# Altium schematic sheet mainsheet.SchDoc
size A4
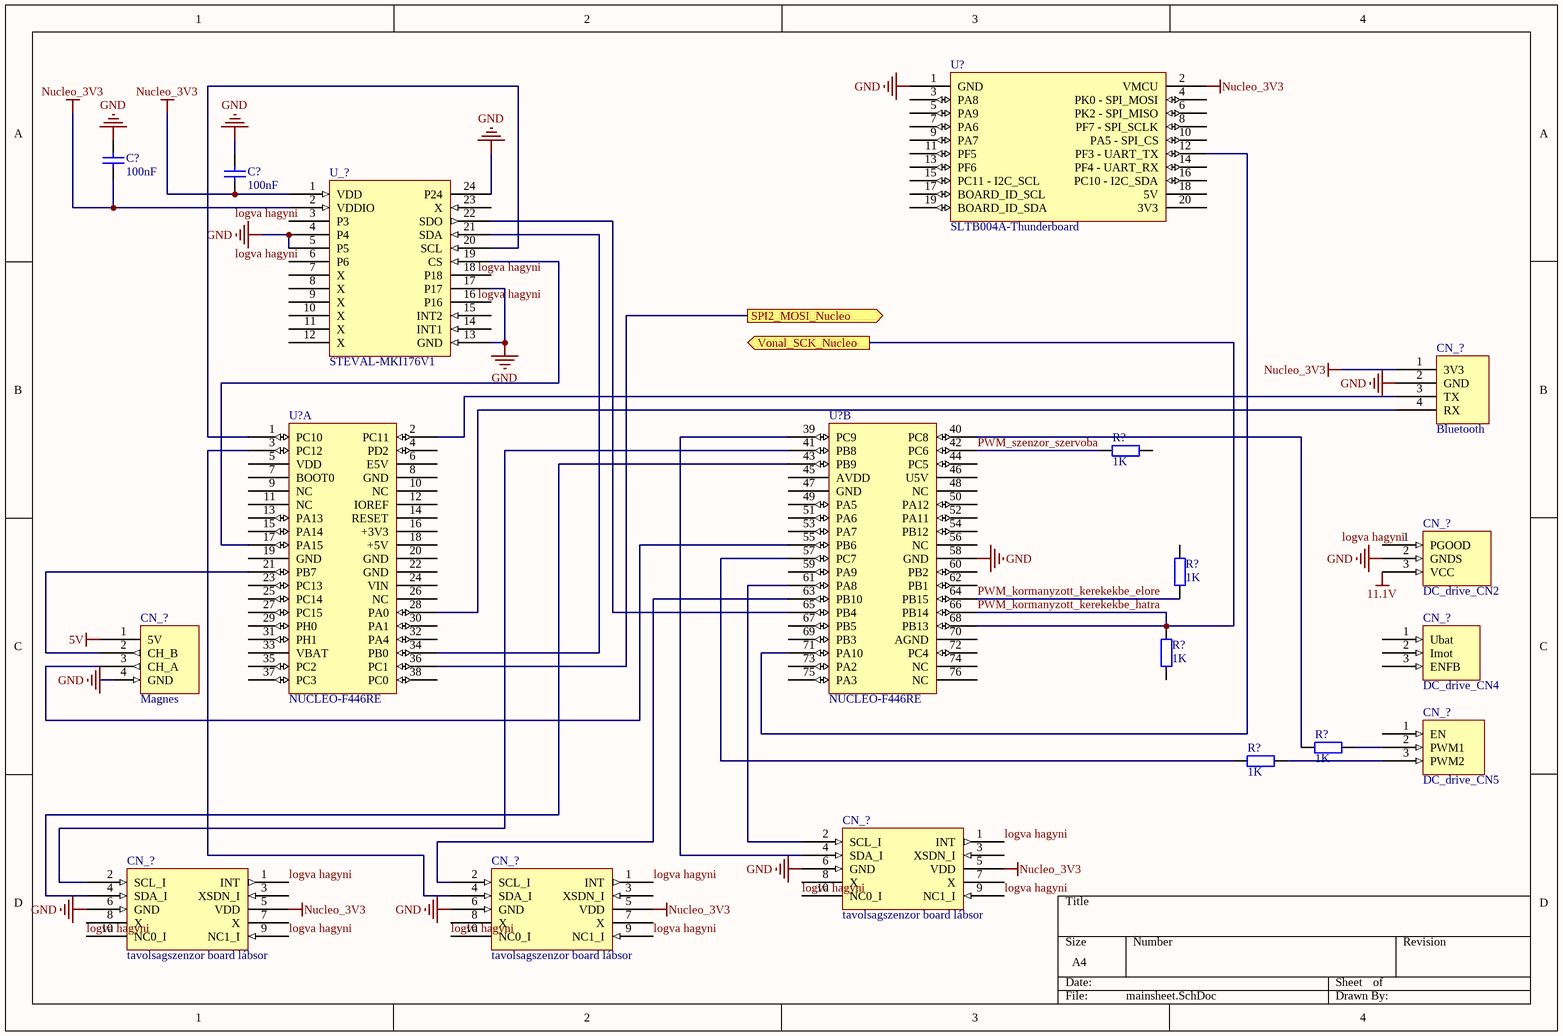
[diagram p0: mainsheet.SchDoc]

## Parts
(Parts that share a designator on the sheet are numbered #1, #2 ... from top to bottom, then left to right.)
C?#1  100nF  [FP_0402_CAP_050]
C?#2  100nF  [FP_0402_CAP_050]
CN_?#1  Bluetooth
CN_?#2  DC_drive_CN2
CN_?#3  Magnes
CN_?#4  DC_drive_CN4
CN_?#5  DC_drive_CN5
CN_?#6  tavolsagszenzor board lábsor
CN_?#7  tavolsagszenzor board lábsor
CN_?#8  tavolsagszenzor board lábsor
R?#1  1K  [FP_0603_RES]
R?#2  1K  [FP_0603_RES]
R?#3  1K  [FP_0603_RES]
R?#4  1K  [FP_0603_RES]
R?#5  1K  [FP_0603_RES]
U?#1  SLTB004A-Thunderboard  [SLTB004A]
U?#2  NUCLEO-F446RE  [FP_NUCLEO-64]  (part A of 2)
U?#3  NUCLEO-F446RE  [FP_NUCLEO-64]  (part B of 2)
U_?  STEVAL-MKI176V1

## Ports
SPI2_MOSI_Nucleo (out), Vonal_SCK_Nucleo (out)

## Nets
5V: CN_?#3.1(5V)
11.1V: CN_?#2.3(VCC)
GND: C?#1.2 C?#2.2 CN_?#1.2(GND) CN_?#2.2(GNDS) CN_?#3.4(GND) CN_?#6.6(GND) CN_?#7.6(GND) CN_?#8.6(GND) U?#1.1(GND) U?#3.58(GND) U_?.4(P4) U_?.5(P5) U_?.13(GND) U_?.17(P17) U_?.24(P24)
Nucleo_3V3: C?#1.1 C?#2.1 CN_?#1.1(3V3) CN_?#6.5(VDD) CN_?#7.5(VDD) CN_?#8.5(VDD) U?#1.2(VMCU) U_?.1(VDD) U_?.2(VDDIO)
logva hagyni: CN_?#6.1(INT) CN_?#6.9(NC1_I) CN_?#6.10(NC0_I) CN_?#7.1(INT) CN_?#7.9(NC1_I) CN_?#7.10(NC0_I) CN_?#8.1(INT) CN_?#8.9(NC1_I) CN_?#8.10(NC0_I)
PWM_kormanyzott_kerekekbe_elore: R?#2.1 U?#3.64(PB15)
PWM_kormanyzott_kerekekbe_hatra: R?#3.1 U?#3.66(PB14) U?#3.68(PB13) ; port Vonal_SCK_Nucleo
PWM_szenzor_szervoba: R?#1.1 U?#3.42(PC6)
SPI2_MOSI_Nucleo: U?#2.36(PC1) ; port SPI2_MOSI_Nucleo
NetCN_?#1_3: CN_?#1.3(TX) U?#2.2(PC11)
NetCN_?#1_4: CN_?#1.4(RX) U?#2.28(PA0)
NetCN_?#3_2: CN_?#3.2(CH_B) U?#2.21(PB7)
NetCN_?#3_3: CN_?#3.3(CH_A) U?#3.55(PB6)
NetCN_?#5_2: CN_?#5.2(PWM1) R?#4.2
NetCN_?#5_3: CN_?#5.3(PWM2) R?#5.2
NetCN_?#6_2: CN_?#6.2(SCL_I) U?#3.61(PA8)
NetCN_?#6_4: CN_?#6.4(SDA_I) U?#3.39(PC9)
NetCN_?#7_2: CN_?#7.2(SCL_I) U?#3.41(PB8)
NetCN_?#7_4: CN_?#7.4(SDA_I) U?#3.43(PB9)
NetCN_?#8_2: CN_?#8.2(SCL_I) U?#3.63(PB10)
NetCN_?#8_4: CN_?#8.4(SDA_I) U?#2.3(PC12)
NetR?#4_1: R?#4.1 U?#3.40(PC8)
NetR?#5_1: R?#5.1 U?#3.57(PC7)
NetU?#1_12: U?#1.12(PF3_-_UART_TX) U?#3.71(PA10)
NetU?#2_1: U?#2.1(PC10) U_?.20(SCL)
NetU?#2_17: U?#2.17(PA15) U_?.19(CS)
NetU?#2_34: U?#2.34(PB0) U_?.21(SDA)
NetU?#3_65: U?#3.65(PB4) U_?.22(SDO)

Not connected (* = marked no-connect by the designer): CN_?#2 1(PGOOD); CN_?#4 1(Ubat) 2(Imot) 3(ENFB); CN_?#5 1(EN); CN_?#6 3(XSDN_I) 7(X) 8(X); CN_?#7 3(XSDN_I) 7(X) 8(X); CN_?#8 3(XSDN_I) 7(X) 8(X); R?#1 2; R?#2 2; R?#3 2; U?#1 3(PA8) 4(PK0_-_SPI_MOSI) 5(PA9) 6(PK2_-_SPI_MISO) 7(PA6) 8(PF7_-_SPI_SCLK) 9(PA7) 10(PA5_-_SPI_CS) 11(PF5) 13(PF6) 14(PF4_-_UART_RX) 15(PC11_-_I2C_SCL) 16(PC10_-_I2C_SDA) 17(BOARD_ID_SCL) 18(5V) 19(BOARD_ID_SDA) 20(3V3); U?#2 4(PD2) 5(VDD) 6(E5V) 7(BOOT0) 8(GND) 9(NC) 10(NC) 11(NC) 12(IOREF) 13(PA13) 14(RESET) 15(PA14) 16(+3V3) 18(+5V) 19(GND) 20(GND) 22(GND) 23(PC13) 24(VIN) 25(PC14) 26(NC) 27(PC15) 29(PH0) 30(PA1) 31(PH1) 32(PA4) 33(VBAT) 35(PC2) 37(PC3) 38(PC0); U?#3 44(PC5) 45(AVDD) 46(U5V) 47(GND) 48(NC) 49(PA5) 50(PA12) 51(PA6) 52(PA11) 53(PA7) 54(PB12) 56(NC) 59(PA9) 60(PB2) 62(PB1) 67(PB5) 69(PB3) 70(AGND) 72(PC4) 73(PA2) 74(NC) 75(PA3) 76(NC); U_? 3(P3) 6(P6) 7(X) 8(X) 9(X) 10(X) 11(X) 12(X) 14(INT1) 15(INT2) 16(P16) 18(P18) 23(X)

## Notes on the sheet
- Labels drawn without touching a wire or pin: logva hagyni

## Library data of the parts
C?#1 C?#2 = CAP: Capacitor; Value: 100nF
CN_?#1 = HC-05: HC-05 tokozva, kérdés, hogy melyik lábon vannak valójában a dolgok; reference1: 100.416.39 (gombbal); reference2: 100.355.62 (gomb nélkül); reference3: 100.355.65 (master-slave); supplier: hestore
CN_?#2 = DC_drive_CN2: CN2 a motvez kártyán a neve; supplier: AUT
CN_?#3 = Encoder: A1333; Supplier: AUT
CN_?#4 = DC_drive_CN4: CN4 a motvez kártyán a neve; supplier: AUT
CN_?#5 = DC_drive_CN5: CN5 a motvez kártyán a neve; supplier: AUT
CN_?#6-CN_?#8 = VL53L1X-satel: supplier: ST
R?#1-R?#5 = RES: Resistor; Value: 1K
U?#1 = SLTB004A: SiLabs Thunderboard Sense 2 module
U?#2 U?#3 = NUCLEO-F446RE: Reference: NUCLEO; Name: Nucleo F446RE; Supplier: Tanszék
U_? = STEVAL-MKI176V1: LSM6DS3H, SPI